# Altium schematic sheet AM3359_A.SchDoc: cihan
size A2; CompanyName: ENVEST; Engineer: CİHAN ÖZDİL
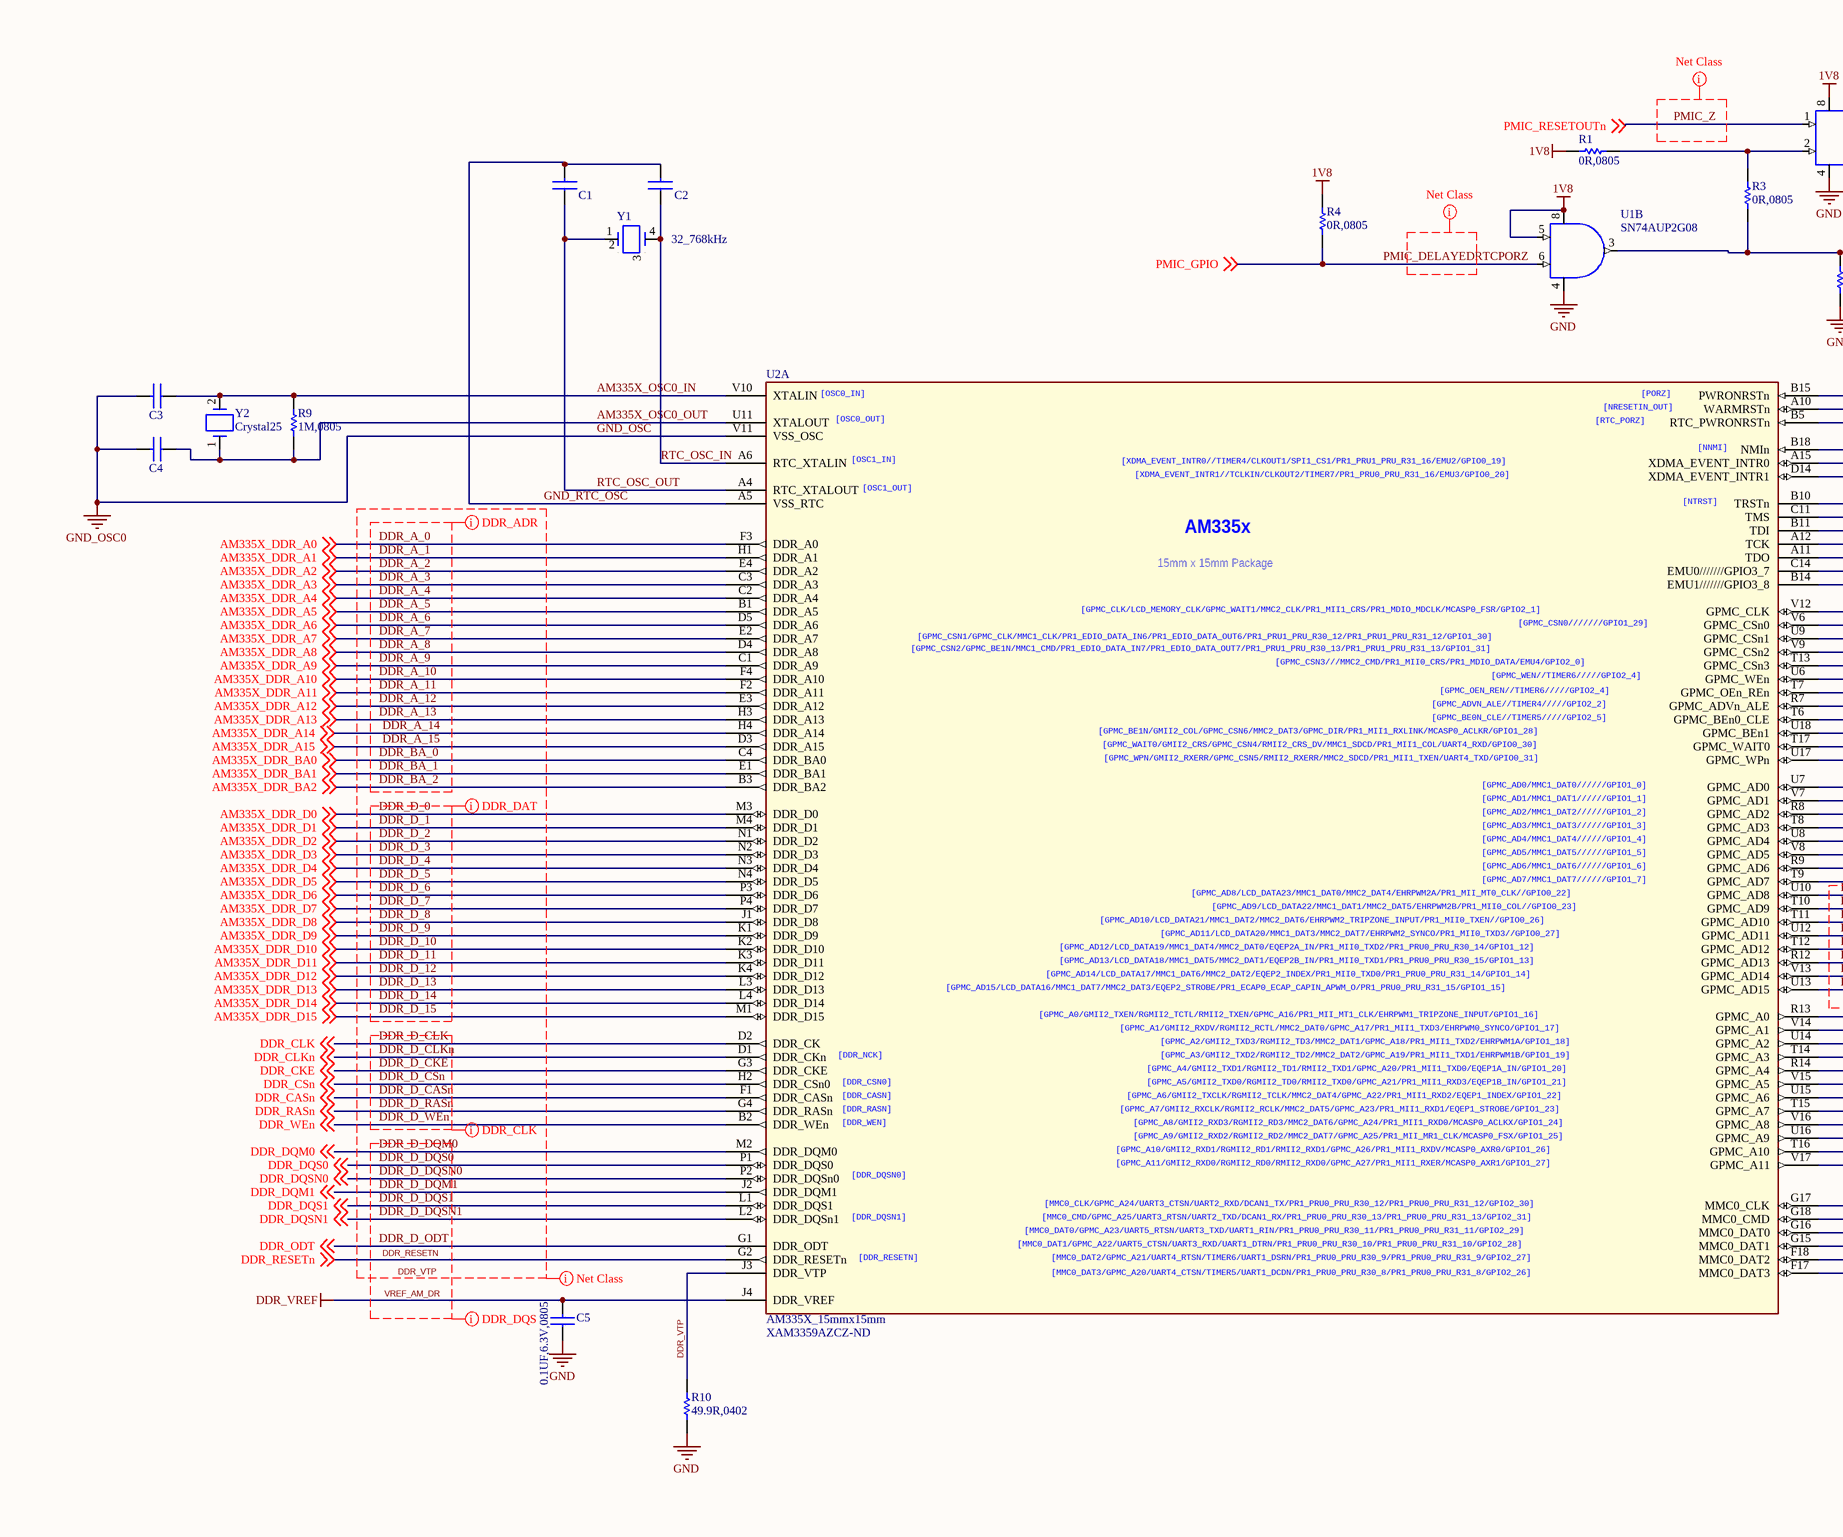
[diagram p0: AM3359_A.SchDoc, left]
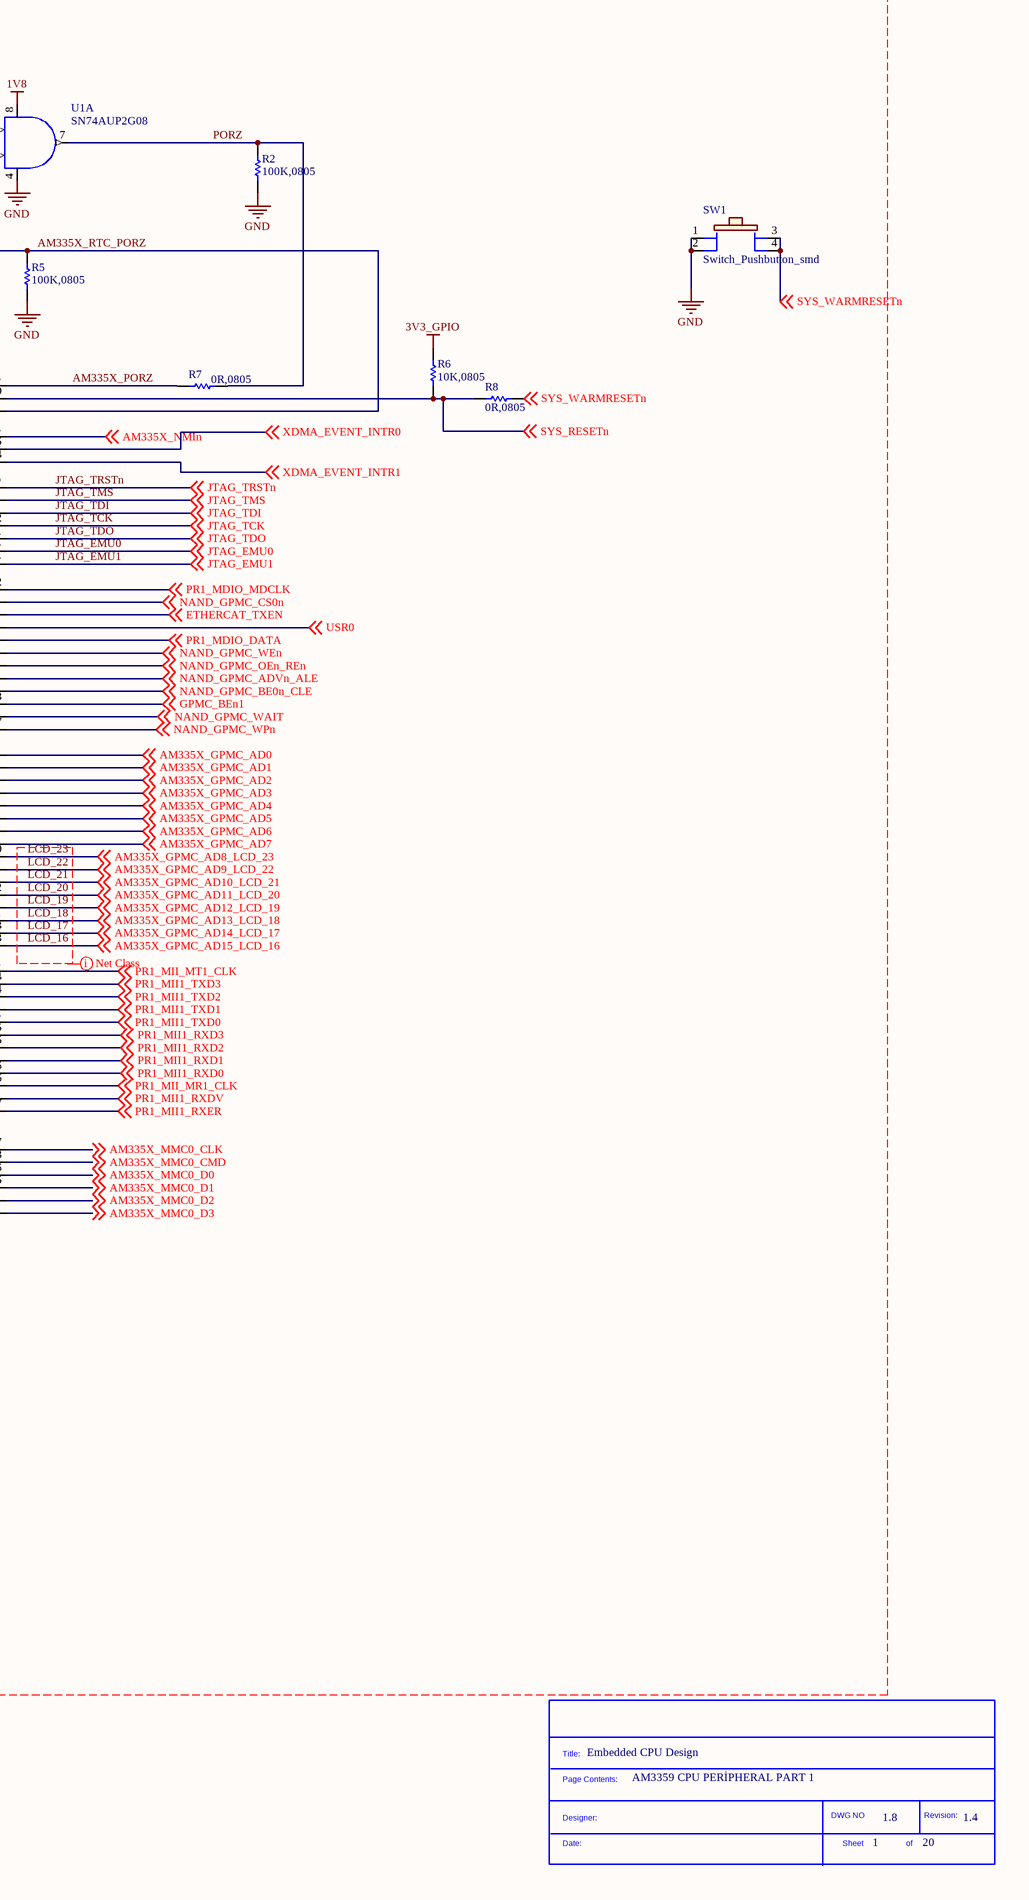
[diagram p1: AM3359_A.SchDoc, right]

## Parts
*?  SDTitleBlock  (value not drawn)  (graphical)
C1  18PF,50V,0805  [0402]  (value not drawn)
C2  18PF,50V,0805  [0402]  (value not drawn)
C3  18PF,50V,0805  [0402]  (value not drawn)
C4  18PF,50V,0805  [0402]  (value not drawn)
C5  0.1UF,6.3V,0805  [0402]
R1  0R,0805  [0402]
R2  100K,0805  [0402]
R3  0R,0805  [0402]
R4  0R,0805  [0402]
R5  100K,0805  [0402]
R6  10K,0805  [0402]
R7  0R,0805  [0402]
R8  0R,0805  [0402]
R9  1M,0805  [0402]
R10  49.9R,0402  [0402]
SW1  Switch_Pushbutton_smd  [SW_B3SL-1022P]
U1  SN74AUP2G08  [U_8_DCU]  (parts A,B of 2)
U2  AM335X_15mmx15mm  Supplier Part Number 1: XAM3359AZCZ-ND  [am33xx_15x15]  (part A of 3)
Y1  32_768kHz  [CRSTAL_RTC]
Y2  Crystal25  [SM_OSC_ABM3]

## Nets
1V8: R1.2 R4.2 U1.5(2A) U1.8(VCC)
3V3_GPIO: R6.2
GND: C5.1 R2.1 R5.1 R10.1 SW1.1 SW1.2 U1.4(GND)
GND_OSC: C3.2 C4.2 U2.V11(VSS_OSC)  [also labelled GND_OSC0]
VREF_AM_DR: C5.2 U2.J4(DDR_VREF)  [also labelled DDR_VREF]
AM335X_GPMC_AD0: U2.U7(GPMC_AD0) ; off-sheet AM335X_GPMC_AD0
AM335X_GPMC_AD1: U2.V7(GPMC_AD1) ; off-sheet AM335X_GPMC_AD1
AM335X_GPMC_AD2: U2.R8(GPMC_AD2) ; off-sheet AM335X_GPMC_AD2
AM335X_GPMC_AD3: U2.T8(GPMC_AD3) ; off-sheet AM335X_GPMC_AD3
AM335X_GPMC_AD4: U2.U8(GPMC_AD4) ; off-sheet AM335X_GPMC_AD4
AM335X_GPMC_AD5: U2.V8(GPMC_AD5) ; off-sheet AM335X_GPMC_AD5
AM335X_GPMC_AD6: U2.R9(GPMC_AD6) ; off-sheet AM335X_GPMC_AD6
AM335X_GPMC_AD7: U2.T9(GPMC_AD7) ; off-sheet AM335X_GPMC_AD7
AM335X_MMC0_CLK: U2.G17(MMC0_CLK) ; off-sheet AM335X_MMC0_CLK
AM335X_MMC0_CMD: U2.G18(MMC0_CMD) ; off-sheet AM335X_MMC0_CMD
AM335X_MMC0_D0: U2.G16(MMC0_DAT0) ; off-sheet AM335X_MMC0_D0
AM335X_MMC0_D1: U2.G15(MMC0_DAT1) ; off-sheet AM335X_MMC0_D1
AM335X_MMC0_D2: U2.F18(MMC0_DAT2) ; off-sheet AM335X_MMC0_D2
AM335X_MMC0_D3: U2.F17(MMC0_DAT3) ; off-sheet AM335X_MMC0_D3
AM335X_NMIn: U2.B18(NMIn) ; off-sheet AM335X_NMIn
AM335X_OSC0_IN: C3.1 R9.2 U2.V10(XTALIN) Y2.2
AM335X_OSC0_OUT: C4.1 R9.1 U2.U11(XTALOUT) Y2.1
AM335X_PORZ: R7.1 U2.B15(PWRONRSTn)
AM335X_RTC_PORZ: R3.1 R5.2 U1.3(2Y) U2.B5(RTC_PWRONRSTn)
DDR_A_0: U2.F3(DDR_A0) ; off-sheet AM335X_DDR_A0  [also labelled AM335X_DDR_A0]
DDR_A_1: U2.H1(DDR_A1) ; off-sheet AM335X_DDR_A1  [also labelled AM335X_DDR_A1]
DDR_A_2: U2.E4(DDR_A2) ; off-sheet AM335X_DDR_A2  [also labelled AM335X_DDR_A2]
DDR_A_3: U2.C3(DDR_A3) ; off-sheet AM335X_DDR_A3  [also labelled AM335X_DDR_A3]
DDR_A_4: U2.C2(DDR_A4) ; off-sheet AM335X_DDR_A4  [also labelled AM335X_DDR_A4]
DDR_A_5: U2.B1(DDR_A5) ; off-sheet AM335X_DDR_A5  [also labelled AM335X_DDR_A5]
DDR_A_6: U2.D5(DDR_A6) ; off-sheet AM335X_DDR_A6  [also labelled AM335X_DDR_A6]
DDR_A_7: U2.E2(DDR_A7) ; off-sheet AM335X_DDR_A7  [also labelled AM335X_DDR_A7]
DDR_A_8: U2.D4(DDR_A8) ; off-sheet AM335X_DDR_A8  [also labelled AM335X_DDR_A8]
DDR_A_9: U2.C1(DDR_A9) ; off-sheet AM335X_DDR_A9  [also labelled AM335X_DDR_A9]
DDR_A_10: U2.F4(DDR_A10) ; off-sheet AM335X_DDR_A10  [also labelled AM335X_DDR_A10]
DDR_A_11: U2.F2(DDR_A11) ; off-sheet AM335X_DDR_A11  [also labelled AM335X_DDR_A11]
DDR_A_12: U2.E3(DDR_A12) ; off-sheet AM335X_DDR_A12  [also labelled AM335X_DDR_A12]
DDR_A_13: U2.H3(DDR_A13) ; off-sheet AM335X_DDR_A13  [also labelled AM335X_DDR_A13]
DDR_A_14: U2.H4(DDR_A14) ; off-sheet AM335X_DDR_A14  [also labelled AM335X_DDR_A14]
DDR_A_15: U2.D3(DDR_A15) ; off-sheet AM335X_DDR_A15  [also labelled AM335X_DDR_A15]
DDR_BA_0: U2.C4(DDR_BA0) ; off-sheet AM335X_DDR_BA0  [also labelled AM335X_DDR_BA0]
DDR_BA_1: U2.E1(DDR_BA1) ; off-sheet AM335X_DDR_BA1  [also labelled AM335X_DDR_BA1]
DDR_BA_2: U2.B3(DDR_BA2) ; off-sheet AM335X_DDR_BA2  [also labelled AM335X_DDR_BA2]
DDR_D_0: U2.M3(DDR_D0) ; off-sheet AM335X_DDR_D0  [also labelled AM335X_DDR_D0]
DDR_D_1: U2.M4(DDR_D1) ; off-sheet AM335X_DDR_D1  [also labelled AM335X_DDR_D1]
DDR_D_2: U2.N1(DDR_D2) ; off-sheet AM335X_DDR_D2  [also labelled AM335X_DDR_D2]
DDR_D_3: U2.N2(DDR_D3) ; off-sheet AM335X_DDR_D3  [also labelled AM335X_DDR_D3]
DDR_D_4: U2.N3(DDR_D4) ; off-sheet AM335X_DDR_D4  [also labelled AM335X_DDR_D4]
DDR_D_5: U2.N4(DDR_D5) ; off-sheet AM335X_DDR_D5  [also labelled AM335X_DDR_D5]
DDR_D_6: U2.P3(DDR_D6) ; off-sheet AM335X_DDR_D6  [also labelled AM335X_DDR_D6]
DDR_D_7: U2.P4(DDR_D7) ; off-sheet AM335X_DDR_D7  [also labelled AM335X_DDR_D7]
DDR_D_8: U2.J1(DDR_D8) ; off-sheet AM335X_DDR_D8  [also labelled AM335X_DDR_D8]
DDR_D_9: U2.K1(DDR_D9) ; off-sheet AM335X_DDR_D9  [also labelled AM335X_DDR_D9]
DDR_D_10: U2.K2(DDR_D10) ; off-sheet AM335X_DDR_D10  [also labelled AM335X_DDR_D10]
DDR_D_11: U2.K3(DDR_D11) ; off-sheet AM335X_DDR_D11  [also labelled AM335X_DDR_D11]
DDR_D_12: U2.K4(DDR_D12) ; off-sheet AM335X_DDR_D12  [also labelled AM335X_DDR_D12]
DDR_D_13: U2.L3(DDR_D13) ; off-sheet AM335X_DDR_D13  [also labelled AM335X_DDR_D13]
DDR_D_14: U2.L4(DDR_D14) ; off-sheet AM335X_DDR_D14  [also labelled AM335X_DDR_D14]
DDR_D_15: U2.M1(DDR_D15) ; off-sheet AM335X_DDR_D15  [also labelled AM335X_DDR_D15]
DDR_D_CASn: U2.F1(DDR_CASn) ; off-sheet DDR_CASn  [also labelled DDR_CASn]
DDR_D_CKE: U2.G3(DDR_CKE) ; off-sheet DDR_CKE  [also labelled DDR_CKE]
DDR_D_CLK: U2.D2(DDR_CK) ; off-sheet DDR_CLK  [also labelled DDR_CLK]
DDR_D_CLKn: U2.D1(DDR_CKn) ; off-sheet DDR_CLKn  [also labelled DDR_CLKn]
DDR_D_CSn: U2.H2(DDR_CSn0) ; off-sheet DDR_CSn  [also labelled DDR_CSn]
DDR_D_DQM0: U2.M2(DDR_DQM0) ; off-sheet DDR_DQM0  [also labelled DDR_DQM0]
DDR_D_DQM1: U2.J2(DDR_DQM1) ; off-sheet DDR_DQM1  [also labelled DDR_DQM1]
DDR_D_DQS0: U2.P1(DDR_DQS0) ; off-sheet DDR_DQS0  [also labelled DDR_DQS0]
DDR_D_DQS1: U2.L1(DDR_DQS1) ; off-sheet DDR_DQS1  [also labelled DDR_DQS1]
DDR_D_DQSN0: U2.P2(DDR_DQSn0) ; off-sheet DDR_DQSN0  [also labelled DDR_DQSN0]
DDR_D_DQSN1: U2.L2(DDR_DQSn1) ; off-sheet DDR_DQSN1  [also labelled DDR_DQSN1]
DDR_D_ODT: U2.G1(DDR_ODT) ; off-sheet DDR_ODT  [also labelled DDR_ODT]
DDR_D_RASn: U2.G4(DDR_RASn) ; off-sheet DDR_RASn  [also labelled DDR_RASn]
DDR_D_WEn: U2.B2(DDR_WEn) ; off-sheet DDR_WEn  [also labelled DDR_WEn]
DDR_RESETN: U2.G2(DDR_RESETn) ; off-sheet DDR_RESETn
DDR_VTP: R10.2 U2.J3(DDR_VTP)
ETHERCAT_TXEN: U2.U9(GPMC_CSn1) ; off-sheet ETHERCAT_TXEN
GND_RTC_OSC: C1.2 C2.2 U2.A5(VSS_RTC)
GPMC_BEn1: U2.U18(GPMC_BEn1) ; off-sheet GPMC_BEn1
JTAG_EMU0: U2.C14(EMU0///////GPIO3_7) ; off-sheet JTAG_EMU0
JTAG_EMU1: U2.B14(EMU1///////GPIO3_8) ; off-sheet JTAG_EMU1
JTAG_TCK: U2.A12(TCK) ; off-sheet JTAG_TCK
JTAG_TDI: U2.B11(TDI) ; off-sheet JTAG_TDI
JTAG_TDO: U2.A11(TDO) ; off-sheet JTAG_TDO
JTAG_TMS: U2.C11(TMS) ; off-sheet JTAG_TMS
JTAG_TRSTn: U2.B10(TRSTn) ; off-sheet JTAG_TRSTn
LCD_16: U2.U13(GPMC_AD15) ; off-sheet AM335X_GPMC_AD15_LCD_16  [also labelled AM335X_GPMC_AD15_LCD_16]
LCD_17: U2.V13(GPMC_AD14) ; off-sheet AM335X_GPMC_AD14_LCD_17  [also labelled AM335X_GPMC_AD14_LCD_17]
LCD_18: U2.R12(GPMC_AD13) ; off-sheet AM335X_GPMC_AD13_LCD_18  [also labelled AM335X_GPMC_AD13_LCD_18]
LCD_19: U2.T12(GPMC_AD12) ; off-sheet AM335X_GPMC_AD12_LCD_19  [also labelled AM335X_GPMC_AD12_LCD_19]
LCD_20: U2.U12(GPMC_AD11) ; off-sheet AM335X_GPMC_AD11_LCD_20  [also labelled AM335X_GPMC_AD11_LCD_20]
LCD_21: U2.T11(GPMC_AD10) ; off-sheet AM335X_GPMC_AD10_LCD_21  [also labelled AM335X_GPMC_AD10_LCD_21]
LCD_22: U2.T10(GPMC_AD9) ; off-sheet AM335X_GPMC_AD9_LCD_22  [also labelled AM335X_GPMC_AD9_LCD_22]
LCD_23: U2.U10(GPMC_AD8) ; off-sheet AM335X_GPMC_AD8_LCD_23  [also labelled AM335X_GPMC_AD8_LCD_23]
NAND_GPMC_ADVn_ALE: U2.R7(GPMC_ADVn_ALE) ; off-sheet NAND_GPMC_ADVn_ALE
NAND_GPMC_BE0n_CLE: U2.T6(GPMC_BEn0_CLE) ; off-sheet NAND_GPMC_BE0n_CLE
NAND_GPMC_CS0n: U2.V6(GPMC_CSn0) ; off-sheet NAND_GPMC_CS0n
NAND_GPMC_OEn_REn: U2.T7(GPMC_OEn_REn) ; off-sheet NAND_GPMC_OEn_REn
NAND_GPMC_WAIT: U2.T17(GPMC_WAIT0) ; off-sheet NAND_GPMC_WAIT
NAND_GPMC_WEn: U2.U6(GPMC_WEn) ; off-sheet NAND_GPMC_WEn
NAND_GPMC_WPn: U2.U17(GPMC_WPn) ; off-sheet NAND_GPMC_WPn
PMIC_DELAYEDRTCPORZ: R4.1 U1.6(2B) ; off-sheet PMIC_GPIO  [also labelled PMIC_GPIO]
PMIC_Z: U1.1(2A) ; off-sheet PMIC_RESETOUTn  [also labelled PMIC_RESETOUTn]
PORZ: R2.2 R7.2 U1.7(2Y)
PR1_MDIO_DATA: U2.T13(GPMC_CSn3) ; off-sheet PR1_MDIO_DATA
PR1_MDIO_MDCLK: U2.V12(GPMC_CLK) ; off-sheet PR1_MDIO_MDCLK
PR1_MII1_RXD0: U2.V16(GPMC_A8) ; off-sheet PR1_MII1_RXD0
PR1_MII1_RXD1: U2.T15(GPMC_A7) ; off-sheet PR1_MII1_RXD1
PR1_MII1_RXD2: U2.U15(GPMC_A6) ; off-sheet PR1_MII1_RXD2
PR1_MII1_RXD3: U2.V15(GPMC_A5) ; off-sheet PR1_MII1_RXD3
PR1_MII1_RXDV: U2.T16(GPMC_A10) ; off-sheet PR1_MII1_RXDV
PR1_MII1_RXER: U2.V17(GPMC_A11) ; off-sheet PR1_MII1_RXER
PR1_MII1_TXD0: U2.R14(GPMC_A4) ; off-sheet PR1_MII1_TXD0
PR1_MII1_TXD1: U2.T14(GPMC_A3) ; off-sheet PR1_MII1_TXD1
PR1_MII1_TXD2: U2.U14(GPMC_A2) ; off-sheet PR1_MII1_TXD2
PR1_MII1_TXD3: U2.V14(GPMC_A1) ; off-sheet PR1_MII1_TXD3
PR1_MII_MR1_CLK: U2.U16(GPMC_A9) ; off-sheet PR1_MII_MR1_CLK
PR1_MII_MT1_CLK: U2.R13(GPMC_A0) ; off-sheet PR1_MII_MT1_CLK
RTC_OSC_IN: C2.1 U2.A6(RTC_XTALIN) Y1.4
RTC_OSC_OUT: C1.1 U2.A4(RTC_XTALOUT) Y1.1
SYS_RESETn: R6.1 R8.1 U2.A10(WARMRSTn) ; off-sheet SYS_RESETn
SYS_WARMRESETn: R8.2 SW1.3 SW1.4 ; off-sheet SYS_WARMRESETn
USR0: U2.V9(GPMC_CSn2) ; off-sheet USR0
XDMA_EVENT_INTR0: U2.A15(XDMA_EVENT_INTR0) ; off-sheet XDMA_EVENT_INTR0
XDMA_EVENT_INTR1: U2.D14(XDMA_EVENT_INTR1) ; off-sheet XDMA_EVENT_INTR1
NetR1_1: R1.1 R3.2 U1.2(2B)

Not connected (* = marked no-connect by the designer): Y1 2 3

## Layout directives
net class AM335PRST: (no net found under the mark), PMIC_Z
net class AM335X_A: 1V8, 3V3_GPIO, AM335X_DDR_A0, AM335X_DDR_A1, AM335X_DDR_A2, AM335X_DDR_A3, AM335X_DDR_A4, AM335X_DDR_A5, AM335X_DDR_A6, AM335X_DDR_A7, AM335X_DDR_A8, AM335X_DDR_A9, AM335X_DDR_A10, AM335X_DDR_A11, AM335X_DDR_A12, AM335X_DDR_A13, AM335X_DDR_A14, AM335X_DDR_A15, AM335X_DDR_BA0, AM335X_DDR_BA1, AM335X_DDR_BA2, AM335X_DDR_D0, AM335X_DDR_D1, AM335X_DDR_D2, AM335X_DDR_D3, AM335X_DDR_D4, AM335X_DDR_D5, AM335X_DDR_D6, AM335X_DDR_D7, AM335X_DDR_D8, AM335X_DDR_D9, AM335X_DDR_D10, AM335X_DDR_D11, AM335X_DDR_D12, AM335X_DDR_D13, AM335X_DDR_D14, AM335X_DDR_D15, AM335X_GPMC_AD0, AM335X_GPMC_AD1, AM335X_GPMC_AD2, AM335X_GPMC_AD3, AM335X_GPMC_AD4, AM335X_GPMC_AD5, AM335X_GPMC_AD6, AM335X_GPMC_AD7, AM335X_GPMC_AD8_LCD_23, AM335X_GPMC_AD9_LCD_22, AM335X_GPMC_AD10_LCD_21, AM335X_GPMC_AD11_LCD_20, AM335X_GPMC_AD12_LCD_19, AM335X_GPMC_AD13_LCD_18, AM335X_GPMC_AD14_LCD_17, AM335X_GPMC_AD15_LCD_16, AM335X_MMC0_CLK, AM335X_MMC0_CMD, AM335X_MMC0_D0, AM335X_MMC0_D1, AM335X_MMC0_D2, AM335X_MMC0_D3, AM335X_NMIn, AM335X_OSC0_IN, AM335X_OSC0_OUT, AM335X_PORZ, AM335X_RTC_PORZ, DDR_A_0, DDR_A_1, DDR_A_2, DDR_A_3, DDR_A_4, DDR_A_5, DDR_A_6, DDR_A_7, DDR_A_8, DDR_A_9, DDR_A_10, DDR_A_11, DDR_A_12, DDR_A_13, DDR_A_14, DDR_A_15, DDR_BA_0, DDR_BA_1, DDR_BA_2, DDR_CASn, DDR_CKE, DDR_CLK, DDR_CLKn, DDR_CSn, DDR_D_0, DDR_D_1, DDR_D_2, DDR_D_3, DDR_D_4, DDR_D_5, DDR_D_6, DDR_D_7, DDR_D_8, DDR_D_9, DDR_D_10, DDR_D_11, DDR_D_12, DDR_D_13, DDR_D_14, DDR_D_15, DDR_D_CASn, DDR_D_CKE, DDR_D_CLK, DDR_D_CLKn, DDR_D_CSn, DDR_D_DQM0, DDR_D_DQM1, DDR_D_DQS0, DDR_D_DQS1, DDR_D_DQSN0, DDR_D_DQSN1, DDR_D_ODT, DDR_D_RASn, DDR_D_WEn, DDR_DQM0, DDR_DQM1, DDR_DQS0, DDR_DQS1, DDR_DQSN0, DDR_DQSN1, DDR_ODT, DDR_RASn, DDR_RESETn, DDR_RESETN, DDR_VREF, DDR_VTP, DDR_WEn, ETHERCAT_TXEN, GND, GND_OSC, GND_OSC0, GND_RTC_OSC, GPMC_BEn1, JTAG_EMU0, JTAG_EMU1, JTAG_TCK, JTAG_TDI, JTAG_TDO, JTAG_TMS, JTAG_TRSTn, LCD_16, LCD_17, LCD_18, LCD_19, LCD_20, LCD_21, LCD_22, LCD_23, NAND_GPMC_ADVn_ALE, NAND_GPMC_BE0n_CLE, NAND_GPMC_CS0n, NAND_GPMC_OEn_REn, NAND_GPMC_WAIT, NAND_GPMC_WEn, NAND_GPMC_WPn, PMIC_DELAYEDRTCPORZ, PMIC_GPIO, PMIC_RESETOUTn, PMIC_Z, PORZ, PR1_MDIO_DATA, PR1_MDIO_MDCLK, PR1_MII1_RXD0, PR1_MII1_RXD1, PR1_MII1_RXD2, PR1_MII1_RXD3, PR1_MII1_RXDV, PR1_MII1_RXER, PR1_MII1_TXD0, PR1_MII1_TXD1, PR1_MII1_TXD2, PR1_MII1_TXD3, PR1_MII_MR1_CLK, PR1_MII_MT1_CLK, RTC_OSC_IN, RTC_OSC_OUT, SYS_RESETn, SYS_WARMRESETn, USR0, VREF_AM_DR, XDMA_EVENT_INTR0, XDMA_EVENT_INTR1
net class LCD_2: 1V8, 3V3_GPIO, AM335X_DDR_A0, AM335X_DDR_A1, AM335X_DDR_A2, AM335X_DDR_A3, AM335X_DDR_A4, AM335X_DDR_A5, AM335X_DDR_A6, AM335X_DDR_A7, AM335X_DDR_A8, AM335X_DDR_A9, AM335X_DDR_A10, AM335X_DDR_A11, AM335X_DDR_A12, AM335X_DDR_A13, AM335X_DDR_A14, AM335X_DDR_A15, AM335X_DDR_BA0, AM335X_DDR_BA1, AM335X_DDR_BA2, AM335X_DDR_D0, AM335X_DDR_D1, AM335X_DDR_D2, AM335X_DDR_D3, AM335X_DDR_D4, AM335X_DDR_D5, AM335X_DDR_D6, AM335X_DDR_D7, AM335X_DDR_D8, AM335X_DDR_D9, AM335X_DDR_D10, AM335X_DDR_D11, AM335X_DDR_D12, AM335X_DDR_D13, AM335X_DDR_D14, AM335X_DDR_D15, AM335X_GPMC_AD0, AM335X_GPMC_AD1, AM335X_GPMC_AD2, AM335X_GPMC_AD3, AM335X_GPMC_AD4, AM335X_GPMC_AD5, AM335X_GPMC_AD6, AM335X_GPMC_AD7, AM335X_GPMC_AD8_LCD_23, AM335X_GPMC_AD9_LCD_22, AM335X_GPMC_AD10_LCD_21, AM335X_GPMC_AD11_LCD_20, AM335X_GPMC_AD12_LCD_19, AM335X_GPMC_AD13_LCD_18, AM335X_GPMC_AD14_LCD_17, AM335X_GPMC_AD15_LCD_16, AM335X_MMC0_CLK, AM335X_MMC0_CMD, AM335X_MMC0_D0, AM335X_MMC0_D1, AM335X_MMC0_D2, AM335X_MMC0_D3, AM335X_NMIn, AM335X_OSC0_IN, AM335X_OSC0_OUT, AM335X_PORZ, AM335X_RTC_PORZ, DDR_A_0, DDR_A_1, DDR_A_2, DDR_A_3, DDR_A_4, DDR_A_5, DDR_A_6, DDR_A_7, DDR_A_8, DDR_A_9, DDR_A_10, DDR_A_11, DDR_A_12, DDR_A_13, DDR_A_14, DDR_A_15, DDR_BA_0, DDR_BA_1, DDR_BA_2, DDR_CASn, DDR_CKE, DDR_CLK, DDR_CLKn, DDR_CSn, DDR_D_0, DDR_D_1, DDR_D_2, DDR_D_3, DDR_D_4, DDR_D_5, DDR_D_6, DDR_D_7, DDR_D_8, DDR_D_9, DDR_D_10, DDR_D_11, DDR_D_12, DDR_D_13, DDR_D_14, DDR_D_15, DDR_D_CASn, DDR_D_CKE, DDR_D_CLK, DDR_D_CLKn, DDR_D_CSn, DDR_D_DQM0, DDR_D_DQM1, DDR_D_DQS0, DDR_D_DQS1, DDR_D_DQSN0, DDR_D_DQSN1, DDR_D_ODT, DDR_D_RASn, DDR_D_WEn, DDR_DQM0, DDR_DQM1, DDR_DQS0, DDR_DQS1, DDR_DQSN0, DDR_DQSN1, DDR_ODT, DDR_RASn, DDR_RESETn, DDR_RESETN, DDR_VREF, DDR_VTP, DDR_WEn, ETHERCAT_TXEN, GND, GND_OSC, GND_OSC0, GND_RTC_OSC, GPMC_BEn1, JTAG_EMU0, JTAG_EMU1, JTAG_TCK, JTAG_TDI, JTAG_TDO, JTAG_TMS, JTAG_TRSTn, LCD_16, LCD_17, LCD_18, LCD_19, LCD_20, LCD_21, LCD_22, LCD_23, NAND_GPMC_ADVn_ALE, NAND_GPMC_BE0n_CLE, NAND_GPMC_CS0n, NAND_GPMC_OEn_REn, NAND_GPMC_WAIT, NAND_GPMC_WEn, NAND_GPMC_WPn, PMIC_DELAYEDRTCPORZ, PMIC_GPIO, PMIC_RESETOUTn, PMIC_Z, PORZ, PR1_MDIO_DATA, PR1_MDIO_MDCLK, PR1_MII1_RXD0, PR1_MII1_RXD1, PR1_MII1_RXD2, PR1_MII1_RXD3, PR1_MII1_RXDV, PR1_MII1_RXER, PR1_MII1_TXD0, PR1_MII1_TXD1, PR1_MII1_TXD2, PR1_MII1_TXD3, PR1_MII_MR1_CLK, PR1_MII_MT1_CLK, RTC_OSC_IN, RTC_OSC_OUT, SYS_RESETn, SYS_WARMRESETn, USR0, VREF_AM_DR, XDMA_EVENT_INTR0, XDMA_EVENT_INTR1
net class DDR_ADR: 1V8, 3V3_GPIO, AM335X_DDR_A0, AM335X_DDR_A1, AM335X_DDR_A2, AM335X_DDR_A3, AM335X_DDR_A4, AM335X_DDR_A5, AM335X_DDR_A6, AM335X_DDR_A7, AM335X_DDR_A8, AM335X_DDR_A9, AM335X_DDR_A10, AM335X_DDR_A11, AM335X_DDR_A12, AM335X_DDR_A13, AM335X_DDR_A14, AM335X_DDR_A15, AM335X_DDR_BA0, AM335X_DDR_BA1, AM335X_DDR_BA2, AM335X_DDR_D0, AM335X_DDR_D1, AM335X_DDR_D2, AM335X_DDR_D3, AM335X_DDR_D4, AM335X_DDR_D5, AM335X_DDR_D6, AM335X_DDR_D7, AM335X_DDR_D8, AM335X_DDR_D9, AM335X_DDR_D10, AM335X_DDR_D11, AM335X_DDR_D12, AM335X_DDR_D13, AM335X_DDR_D14, AM335X_DDR_D15, AM335X_GPMC_AD0, AM335X_GPMC_AD1, AM335X_GPMC_AD2, AM335X_GPMC_AD3, AM335X_GPMC_AD4, AM335X_GPMC_AD5, AM335X_GPMC_AD6, AM335X_GPMC_AD7, AM335X_GPMC_AD8_LCD_23, AM335X_GPMC_AD9_LCD_22, AM335X_GPMC_AD10_LCD_21, AM335X_GPMC_AD11_LCD_20, AM335X_GPMC_AD12_LCD_19, AM335X_GPMC_AD13_LCD_18, AM335X_GPMC_AD14_LCD_17, AM335X_GPMC_AD15_LCD_16, AM335X_MMC0_CLK, AM335X_MMC0_CMD, AM335X_MMC0_D0, AM335X_MMC0_D1, AM335X_MMC0_D2, AM335X_MMC0_D3, AM335X_NMIn, AM335X_OSC0_IN, AM335X_OSC0_OUT, AM335X_PORZ, AM335X_RTC_PORZ, DDR_A_0, DDR_A_1, DDR_A_2, DDR_A_3, DDR_A_4, DDR_A_5, DDR_A_6, DDR_A_7, DDR_A_8, DDR_A_9, DDR_A_10, DDR_A_11, DDR_A_12, DDR_A_13, DDR_A_14, DDR_A_15, DDR_BA_0, DDR_BA_1, DDR_BA_2, DDR_CASn, DDR_CKE, DDR_CLK, DDR_CLKn, DDR_CSn, DDR_D_0, DDR_D_1, DDR_D_2, DDR_D_3, DDR_D_4, DDR_D_5, DDR_D_6, DDR_D_7, DDR_D_8, DDR_D_9, DDR_D_10, DDR_D_11, DDR_D_12, DDR_D_13, DDR_D_14, DDR_D_15, DDR_D_CASn, DDR_D_CKE, DDR_D_CLK, DDR_D_CLKn, DDR_D_CSn, DDR_D_DQM0, DDR_D_DQM1, DDR_D_DQS0, DDR_D_DQS1, DDR_D_DQSN0, DDR_D_DQSN1, DDR_D_ODT, DDR_D_RASn, DDR_D_WEn, DDR_DQM0, DDR_DQM1, DDR_DQS0, DDR_DQS1, DDR_DQSN0, DDR_DQSN1, DDR_ODT, DDR_RASn, DDR_RESETn, DDR_RESETN, DDR_VREF, DDR_VTP, DDR_WEn, ETHERCAT_TXEN, GND, GND_OSC, GND_OSC0, GND_RTC_OSC, GPMC_BEn1, JTAG_EMU0, JTAG_EMU1, JTAG_TCK, JTAG_TDI, JTAG_TDO, JTAG_TMS, JTAG_TRSTn, LCD_16, LCD_17, LCD_18, LCD_19, LCD_20, LCD_21, LCD_22, LCD_23, NAND_GPMC_ADVn_ALE, NAND_GPMC_BE0n_CLE, NAND_GPMC_CS0n, NAND_GPMC_OEn_REn, NAND_GPMC_WAIT, NAND_GPMC_WEn, NAND_GPMC_WPn, PMIC_DELAYEDRTCPORZ, PMIC_GPIO, PMIC_RESETOUTn, PMIC_Z, PORZ, PR1_MDIO_DATA, PR1_MDIO_MDCLK, PR1_MII1_RXD0, PR1_MII1_RXD1, PR1_MII1_RXD2, PR1_MII1_RXD3, PR1_MII1_RXDV, PR1_MII1_RXER, PR1_MII1_TXD0, PR1_MII1_TXD1, PR1_MII1_TXD2, PR1_MII1_TXD3, PR1_MII_MR1_CLK, PR1_MII_MT1_CLK, RTC_OSC_IN, RTC_OSC_OUT, SYS_RESETn, SYS_WARMRESETn, USR0, VREF_AM_DR, XDMA_EVENT_INTR0, XDMA_EVENT_INTR1
net class DDR_DAT: 1V8, 3V3_GPIO, AM335X_DDR_A0, AM335X_DDR_A1, AM335X_DDR_A2, AM335X_DDR_A3, AM335X_DDR_A4, AM335X_DDR_A5, AM335X_DDR_A6, AM335X_DDR_A7, AM335X_DDR_A8, AM335X_DDR_A9, AM335X_DDR_A10, AM335X_DDR_A11, AM335X_DDR_A12, AM335X_DDR_A13, AM335X_DDR_A14, AM335X_DDR_A15, AM335X_DDR_BA0, AM335X_DDR_BA1, AM335X_DDR_BA2, AM335X_DDR_D0, AM335X_DDR_D1, AM335X_DDR_D2, AM335X_DDR_D3, AM335X_DDR_D4, AM335X_DDR_D5, AM335X_DDR_D6, AM335X_DDR_D7, AM335X_DDR_D8, AM335X_DDR_D9, AM335X_DDR_D10, AM335X_DDR_D11, AM335X_DDR_D12, AM335X_DDR_D13, AM335X_DDR_D14, AM335X_DDR_D15, AM335X_GPMC_AD0, AM335X_GPMC_AD1, AM335X_GPMC_AD2, AM335X_GPMC_AD3, AM335X_GPMC_AD4, AM335X_GPMC_AD5, AM335X_GPMC_AD6, AM335X_GPMC_AD7, AM335X_GPMC_AD8_LCD_23, AM335X_GPMC_AD9_LCD_22, AM335X_GPMC_AD10_LCD_21, AM335X_GPMC_AD11_LCD_20, AM335X_GPMC_AD12_LCD_19, AM335X_GPMC_AD13_LCD_18, AM335X_GPMC_AD14_LCD_17, AM335X_GPMC_AD15_LCD_16, AM335X_MMC0_CLK, AM335X_MMC0_CMD, AM335X_MMC0_D0, AM335X_MMC0_D1, AM335X_MMC0_D2, AM335X_MMC0_D3, AM335X_NMIn, AM335X_OSC0_IN, AM335X_OSC0_OUT, AM335X_PORZ, AM335X_RTC_PORZ, DDR_A_0, DDR_A_1, DDR_A_2, DDR_A_3, DDR_A_4, DDR_A_5, DDR_A_6, DDR_A_7, DDR_A_8, DDR_A_9, DDR_A_10, DDR_A_11, DDR_A_12, DDR_A_13, DDR_A_14, DDR_A_15, DDR_BA_0, DDR_BA_1, DDR_BA_2, DDR_CASn, DDR_CKE, DDR_CLK, DDR_CLKn, DDR_CSn, DDR_D_0, DDR_D_1, DDR_D_2, DDR_D_3, DDR_D_4, DDR_D_5, DDR_D_6, DDR_D_7, DDR_D_8, DDR_D_9, DDR_D_10, DDR_D_11, DDR_D_12, DDR_D_13, DDR_D_14, DDR_D_15, DDR_D_CASn, DDR_D_CKE, DDR_D_CLK, DDR_D_CLKn, DDR_D_CSn, DDR_D_DQM0, DDR_D_DQM1, DDR_D_DQS0, DDR_D_DQS1, DDR_D_DQSN0, DDR_D_DQSN1, DDR_D_ODT, DDR_D_RASn, DDR_D_WEn, DDR_DQM0, DDR_DQM1, DDR_DQS0, DDR_DQS1, DDR_DQSN0, DDR_DQSN1, DDR_ODT, DDR_RASn, DDR_RESETn, DDR_RESETN, DDR_VREF, DDR_VTP, DDR_WEn, ETHERCAT_TXEN, GND, GND_OSC, GND_OSC0, GND_RTC_OSC, GPMC_BEn1, JTAG_EMU0, JTAG_EMU1, JTAG_TCK, JTAG_TDI, JTAG_TDO, JTAG_TMS, JTAG_TRSTn, LCD_16, LCD_17, LCD_18, LCD_19, LCD_20, LCD_21, LCD_22, LCD_23, NAND_GPMC_ADVn_ALE, NAND_GPMC_BE0n_CLE, NAND_GPMC_CS0n, NAND_GPMC_OEn_REn, NAND_GPMC_WAIT, NAND_GPMC_WEn, NAND_GPMC_WPn, PMIC_DELAYEDRTCPORZ, PMIC_GPIO, PMIC_RESETOUTn, PMIC_Z, PORZ, PR1_MDIO_DATA, PR1_MDIO_MDCLK, PR1_MII1_RXD0, PR1_MII1_RXD1, PR1_MII1_RXD2, PR1_MII1_RXD3, PR1_MII1_RXDV, PR1_MII1_RXER, PR1_MII1_TXD0, PR1_MII1_TXD1, PR1_MII1_TXD2, PR1_MII1_TXD3, PR1_MII_MR1_CLK, PR1_MII_MT1_CLK, RTC_OSC_IN, RTC_OSC_OUT, SYS_RESETn, SYS_WARMRESETn, USR0, VREF_AM_DR, XDMA_EVENT_INTR0, XDMA_EVENT_INTR1
net class DDR_DQS: 1V8, 3V3_GPIO, AM335X_DDR_A0, AM335X_DDR_A1, AM335X_DDR_A2, AM335X_DDR_A3, AM335X_DDR_A4, AM335X_DDR_A5, AM335X_DDR_A6, AM335X_DDR_A7, AM335X_DDR_A8, AM335X_DDR_A9, AM335X_DDR_A10, AM335X_DDR_A11, AM335X_DDR_A12, AM335X_DDR_A13, AM335X_DDR_A14, AM335X_DDR_A15, AM335X_DDR_BA0, AM335X_DDR_BA1, AM335X_DDR_BA2, AM335X_DDR_D0, AM335X_DDR_D1, AM335X_DDR_D2, AM335X_DDR_D3, AM335X_DDR_D4, AM335X_DDR_D5, AM335X_DDR_D6, AM335X_DDR_D7, AM335X_DDR_D8, AM335X_DDR_D9, AM335X_DDR_D10, AM335X_DDR_D11, AM335X_DDR_D12, AM335X_DDR_D13, AM335X_DDR_D14, AM335X_DDR_D15, AM335X_GPMC_AD0, AM335X_GPMC_AD1, AM335X_GPMC_AD2, AM335X_GPMC_AD3, AM335X_GPMC_AD4, AM335X_GPMC_AD5, AM335X_GPMC_AD6, AM335X_GPMC_AD7, AM335X_GPMC_AD8_LCD_23, AM335X_GPMC_AD9_LCD_22, AM335X_GPMC_AD10_LCD_21, AM335X_GPMC_AD11_LCD_20, AM335X_GPMC_AD12_LCD_19, AM335X_GPMC_AD13_LCD_18, AM335X_GPMC_AD14_LCD_17, AM335X_GPMC_AD15_LCD_16, AM335X_MMC0_CLK, AM335X_MMC0_CMD, AM335X_MMC0_D0, AM335X_MMC0_D1, AM335X_MMC0_D2, AM335X_MMC0_D3, AM335X_NMIn, AM335X_OSC0_IN, AM335X_OSC0_OUT, AM335X_PORZ, AM335X_RTC_PORZ, DDR_A_0, DDR_A_1, DDR_A_2, DDR_A_3, DDR_A_4, DDR_A_5, DDR_A_6, DDR_A_7, DDR_A_8, DDR_A_9, DDR_A_10, DDR_A_11, DDR_A_12, DDR_A_13, DDR_A_14, DDR_A_15, DDR_BA_0, DDR_BA_1, DDR_BA_2, DDR_CASn, DDR_CKE, DDR_CLK, DDR_CLKn, DDR_CSn, DDR_D_0, DDR_D_1, DDR_D_2, DDR_D_3, DDR_D_4, DDR_D_5, DDR_D_6, DDR_D_7, DDR_D_8, DDR_D_9, DDR_D_10, DDR_D_11, DDR_D_12, DDR_D_13, DDR_D_14, DDR_D_15, DDR_D_CASn, DDR_D_CKE, DDR_D_CLK, DDR_D_CLKn, DDR_D_CSn, DDR_D_DQM0, DDR_D_DQM1, DDR_D_DQS0, DDR_D_DQS1, DDR_D_DQSN0, DDR_D_DQSN1, DDR_D_ODT, DDR_D_RASn, DDR_D_WEn, DDR_DQM0, DDR_DQM1, DDR_DQS0, DDR_DQS1, DDR_DQSN0, DDR_DQSN1, DDR_ODT, DDR_RASn, DDR_RESETn, DDR_RESETN, DDR_VREF, DDR_VTP, DDR_WEn, ETHERCAT_TXEN, GND, GND_OSC, GND_OSC0, GND_RTC_OSC, GPMC_BEn1, JTAG_EMU0, JTAG_EMU1, JTAG_TCK, JTAG_TDI, JTAG_TDO, JTAG_TMS, JTAG_TRSTn, LCD_16, LCD_17, LCD_18, LCD_19, LCD_20, LCD_21, LCD_22, LCD_23, NAND_GPMC_ADVn_ALE, NAND_GPMC_BE0n_CLE, NAND_GPMC_CS0n, NAND_GPMC_OEn_REn, NAND_GPMC_WAIT, NAND_GPMC_WEn, NAND_GPMC_WPn, PMIC_DELAYEDRTCPORZ, PMIC_GPIO, PMIC_RESETOUTn, PMIC_Z, PORZ, PR1_MDIO_DATA, PR1_MDIO_MDCLK, PR1_MII1_RXD0, PR1_MII1_RXD1, PR1_MII1_RXD2, PR1_MII1_RXD3, PR1_MII1_RXDV, PR1_MII1_RXER, PR1_MII1_TXD0, PR1_MII1_TXD1, PR1_MII1_TXD2, PR1_MII1_TXD3, PR1_MII_MR1_CLK, PR1_MII_MT1_CLK, RTC_OSC_IN, RTC_OSC_OUT, SYS_RESETn, SYS_WARMRESETn, USR0, VREF_AM_DR, XDMA_EVENT_INTR0, XDMA_EVENT_INTR1
net class DDR_CLK: 1V8, 3V3_GPIO, AM335X_DDR_A0, AM335X_DDR_A1, AM335X_DDR_A2, AM335X_DDR_A3, AM335X_DDR_A4, AM335X_DDR_A5, AM335X_DDR_A6, AM335X_DDR_A7, AM335X_DDR_A8, AM335X_DDR_A9, AM335X_DDR_A10, AM335X_DDR_A11, AM335X_DDR_A12, AM335X_DDR_A13, AM335X_DDR_A14, AM335X_DDR_A15, AM335X_DDR_BA0, AM335X_DDR_BA1, AM335X_DDR_BA2, AM335X_DDR_D0, AM335X_DDR_D1, AM335X_DDR_D2, AM335X_DDR_D3, AM335X_DDR_D4, AM335X_DDR_D5, AM335X_DDR_D6, AM335X_DDR_D7, AM335X_DDR_D8, AM335X_DDR_D9, AM335X_DDR_D10, AM335X_DDR_D11, AM335X_DDR_D12, AM335X_DDR_D13, AM335X_DDR_D14, AM335X_DDR_D15, AM335X_GPMC_AD0, AM335X_GPMC_AD1, AM335X_GPMC_AD2, AM335X_GPMC_AD3, AM335X_GPMC_AD4, AM335X_GPMC_AD5, AM335X_GPMC_AD6, AM335X_GPMC_AD7, AM335X_GPMC_AD8_LCD_23, AM335X_GPMC_AD9_LCD_22, AM335X_GPMC_AD10_LCD_21, AM335X_GPMC_AD11_LCD_20, AM335X_GPMC_AD12_LCD_19, AM335X_GPMC_AD13_LCD_18, AM335X_GPMC_AD14_LCD_17, AM335X_GPMC_AD15_LCD_16, AM335X_MMC0_CLK, AM335X_MMC0_CMD, AM335X_MMC0_D0, AM335X_MMC0_D1, AM335X_MMC0_D2, AM335X_MMC0_D3, AM335X_NMIn, AM335X_OSC0_IN, AM335X_OSC0_OUT, AM335X_PORZ, AM335X_RTC_PORZ, DDR_A_0, DDR_A_1, DDR_A_2, DDR_A_3, DDR_A_4, DDR_A_5, DDR_A_6, DDR_A_7, DDR_A_8, DDR_A_9, DDR_A_10, DDR_A_11, DDR_A_12, DDR_A_13, DDR_A_14, DDR_A_15, DDR_BA_0, DDR_BA_1, DDR_BA_2, DDR_CASn, DDR_CKE, DDR_CLK, DDR_CLKn, DDR_CSn, DDR_D_0, DDR_D_1, DDR_D_2, DDR_D_3, DDR_D_4, DDR_D_5, DDR_D_6, DDR_D_7, DDR_D_8, DDR_D_9, DDR_D_10, DDR_D_11, DDR_D_12, DDR_D_13, DDR_D_14, DDR_D_15, DDR_D_CASn, DDR_D_CKE, DDR_D_CLK, DDR_D_CLKn, DDR_D_CSn, DDR_D_DQM0, DDR_D_DQM1, DDR_D_DQS0, DDR_D_DQS1, DDR_D_DQSN0, DDR_D_DQSN1, DDR_D_ODT, DDR_D_RASn, DDR_D_WEn, DDR_DQM0, DDR_DQM1, DDR_DQS0, DDR_DQS1, DDR_DQSN0, DDR_DQSN1, DDR_ODT, DDR_RASn, DDR_RESETn, DDR_RESETN, DDR_VREF, DDR_VTP, DDR_WEn, ETHERCAT_TXEN, GND, GND_OSC, GND_OSC0, GND_RTC_OSC, GPMC_BEn1, JTAG_EMU0, JTAG_EMU1, JTAG_TCK, JTAG_TDI, JTAG_TDO, JTAG_TMS, JTAG_TRSTn, LCD_16, LCD_17, LCD_18, LCD_19, LCD_20, LCD_21, LCD_22, LCD_23, NAND_GPMC_ADVn_ALE, NAND_GPMC_BE0n_CLE, NAND_GPMC_CS0n, NAND_GPMC_OEn_REn, NAND_GPMC_WAIT, NAND_GPMC_WEn, NAND_GPMC_WPn, PMIC_DELAYEDRTCPORZ, PMIC_GPIO, PMIC_RESETOUTn, PMIC_Z, PORZ, PR1_MDIO_DATA, PR1_MDIO_MDCLK, PR1_MII1_RXD0, PR1_MII1_RXD1, PR1_MII1_RXD2, PR1_MII1_RXD3, PR1_MII1_RXDV, PR1_MII1_RXER, PR1_MII1_TXD0, PR1_MII1_TXD1, PR1_MII1_TXD2, PR1_MII1_TXD3, PR1_MII_MR1_CLK, PR1_MII_MT1_CLK, RTC_OSC_IN, RTC_OSC_OUT, SYS_RESETn, SYS_WARMRESETn, USR0, VREF_AM_DR, XDMA_EVENT_INTR0, XDMA_EVENT_INTR1
net class DDR3: 1V8, 3V3_GPIO, AM335X_DDR_A0, AM335X_DDR_A1, AM335X_DDR_A2, AM335X_DDR_A3, AM335X_DDR_A4, AM335X_DDR_A5, AM335X_DDR_A6, AM335X_DDR_A7, AM335X_DDR_A8, AM335X_DDR_A9, AM335X_DDR_A10, AM335X_DDR_A11, AM335X_DDR_A12, AM335X_DDR_A13, AM335X_DDR_A14, AM335X_DDR_A15, AM335X_DDR_BA0, AM335X_DDR_BA1, AM335X_DDR_BA2, AM335X_DDR_D0, AM335X_DDR_D1, AM335X_DDR_D2, AM335X_DDR_D3, AM335X_DDR_D4, AM335X_DDR_D5, AM335X_DDR_D6, AM335X_DDR_D7, AM335X_DDR_D8, AM335X_DDR_D9, AM335X_DDR_D10, AM335X_DDR_D11, AM335X_DDR_D12, AM335X_DDR_D13, AM335X_DDR_D14, AM335X_DDR_D15, AM335X_GPMC_AD0, AM335X_GPMC_AD1, AM335X_GPMC_AD2, AM335X_GPMC_AD3, AM335X_GPMC_AD4, AM335X_GPMC_AD5, AM335X_GPMC_AD6, AM335X_GPMC_AD7, AM335X_GPMC_AD8_LCD_23, AM335X_GPMC_AD9_LCD_22, AM335X_GPMC_AD10_LCD_21, AM335X_GPMC_AD11_LCD_20, AM335X_GPMC_AD12_LCD_19, AM335X_GPMC_AD13_LCD_18, AM335X_GPMC_AD14_LCD_17, AM335X_GPMC_AD15_LCD_16, AM335X_MMC0_CLK, AM335X_MMC0_CMD, AM335X_MMC0_D0, AM335X_MMC0_D1, AM335X_MMC0_D2, AM335X_MMC0_D3, AM335X_NMIn, AM335X_OSC0_IN, AM335X_OSC0_OUT, AM335X_PORZ, AM335X_RTC_PORZ, DDR_A_0, DDR_A_1, DDR_A_2, DDR_A_3, DDR_A_4, DDR_A_5, DDR_A_6, DDR_A_7, DDR_A_8, DDR_A_9, DDR_A_10, DDR_A_11, DDR_A_12, DDR_A_13, DDR_A_14, DDR_A_15, DDR_BA_0, DDR_BA_1, DDR_BA_2, DDR_CASn, DDR_CKE, DDR_CLK, DDR_CLKn, DDR_CSn, DDR_D_0, DDR_D_1, DDR_D_2, DDR_D_3, DDR_D_4, DDR_D_5, DDR_D_6, DDR_D_7, DDR_D_8, DDR_D_9, DDR_D_10, DDR_D_11, DDR_D_12, DDR_D_13, DDR_D_14, DDR_D_15, DDR_D_CASn, DDR_D_CKE, DDR_D_CLK, DDR_D_CLKn, DDR_D_CSn, DDR_D_DQM0, DDR_D_DQM1, DDR_D_DQS0, DDR_D_DQS1, DDR_D_DQSN0, DDR_D_DQSN1, DDR_D_ODT, DDR_D_RASn, DDR_D_WEn, DDR_DQM0, DDR_DQM1, DDR_DQS0, DDR_DQS1, DDR_DQSN0, DDR_DQSN1, DDR_ODT, DDR_RASn, DDR_RESETn, DDR_RESETN, DDR_VREF, DDR_VTP, DDR_WEn, ETHERCAT_TXEN, GND, GND_OSC, GND_OSC0, GND_RTC_OSC, GPMC_BEn1, JTAG_EMU0, JTAG_EMU1, JTAG_TCK, JTAG_TDI, JTAG_TDO, JTAG_TMS, JTAG_TRSTn, LCD_16, LCD_17, LCD_18, LCD_19, LCD_20, LCD_21, LCD_22, LCD_23, NAND_GPMC_ADVn_ALE, NAND_GPMC_BE0n_CLE, NAND_GPMC_CS0n, NAND_GPMC_OEn_REn, NAND_GPMC_WAIT, NAND_GPMC_WEn, NAND_GPMC_WPn, PMIC_DELAYEDRTCPORZ, PMIC_GPIO, PMIC_RESETOUTn, PMIC_Z, PORZ, PR1_MDIO_DATA, PR1_MDIO_MDCLK, PR1_MII1_RXD0, PR1_MII1_RXD1, PR1_MII1_RXD2, PR1_MII1_RXD3, PR1_MII1_RXDV, PR1_MII1_RXER, PR1_MII1_TXD0, PR1_MII1_TXD1, PR1_MII1_TXD2, PR1_MII1_TXD3, PR1_MII_MR1_CLK, PR1_MII_MT1_CLK, RTC_OSC_IN, RTC_OSC_OUT, SYS_RESETn, SYS_WARMRESETn, USR0, VREF_AM_DR, XDMA_EVENT_INTR0, XDMA_EVENT_INTR1

## Notes on the sheet
- Embedded CPU Design
- AM3359 CPU PERİPHERAL PART 1
- 1
- 1.8
- 20
- 1.4
- Labels drawn without touching a wire or pin: DDR_VTP
- (in symbol AM335X_15mmx15mm, part A) [OSC0_IN]; [PORZ]; [NRESETIN_OUT]; [OSC0_OUT]; [RTC_PORZ]; [NNMI]; [OSC1_IN]; [XDMA_EVENT_INTR0//TIMER4/CLKOUT1/SPI1_CS1/PR1_PRU1_PRU_R31_16/EMU2/GPIO0_19]; [XDMA_EVENT_INTR1//TCLKIN/CLKOUT2/TIMER7/PR1_PRU0_PRU_R31_16/EMU3/GPIO0_20]; [OSC1_OUT]; [NTRST]; AM335x; 15mm x 15mm Package; [GPMC_CLK/LCD_MEMORY_CLK/GPMC_WAIT1/MMC2_CLK/PR1_MII1_CRS/PR1_MDIO_MDCLK/MCASP0_FSR/GPIO2_1]; [GPMC_CSN0///////GPIO1_29]; [GPMC_CSN1/GPMC_CLK/MMC1_CLK/PR1_EDIO_DATA_IN6/PR1_EDIO_DATA_OUT6/PR1_PRU1_PRU_R30_12/PR1_PRU1_PRU_R31_12/GPIO1_30]; [GPMC_CSN2/GPMC_BE1N/MMC1_CMD/PR1_EDIO_DATA_IN7/PR1_EDIO_DATA_OUT7/PR1_PRU1_PRU_R30_13/PR1_PRU1_PRU_R31_13/GPIO1_31]; [GPMC_CSN3///MMC2_CMD/PR1_MII0_CRS/PR1_MDIO_DATA/EMU4/GPIO2_0]; [GPMC_WEN//TIMER6/////GPIO2_4]; [GPMC_OEN_REN//TIMER6/////GPIO2_4]; [GPMC_ADVN_ALE//TIMER4/////GPIO2_2]; [GPMC_BE0N_CLE//TIMER5/////GPIO2_5]; [GPMC_BE1N/GMII2_COL/GPMC_CSN6/MMC2_DAT3/GPMC_DIR/PR1_MII1_RXLINK/MCASP0_ACLKR/GPIO1_28]; [GPMC_WAIT0/GMII2_CRS/GPMC_CSN4/RMII2_CRS_DV/MMC1_SDCD/PR1_MII1_COL/UART4_RXD/GPIO0_30]; [GPMC_WPN/GMII2_RXERR/GPMC_CSN5/RMII2_RXERR/MMC2_SDCD/PR1_MII1_TXEN/UART4_TXD/GPIO0_31]; [GPMC_AD0/MMC1_DAT0//////GPIO1_0]; [GPMC_AD1/MMC1_DAT1//////GPIO1_1]; [GPMC_AD2/MMC1_DAT2//////GPIO1_2]; [GPMC_AD3/MMC1_DAT3//////GPIO1_3]; [GPMC_AD4/MMC1_DAT4//////GPIO1_4]; [GPMC_AD5/MMC1_DAT5//////GPIO1_5]; [GPMC_AD6/MMC1_DAT6//////GPIO1_6]; [GPMC_AD7/MMC1_DAT7//////GPIO1_7]; [GPMC_AD8/LCD_DATA23/MMC1_DAT0/MMC2_DAT4/EHRPWM2A/PR1_MII_MT0_CLK//GPIO0_22]; [GPMC_AD9/LCD_DATA22/MMC1_DAT1/MMC2_DAT5/EHRPWM2B/PR1_MII0_COL//GPIO0_23]; [GPMC_AD10/LCD_DATA21/MMC1_DAT2/MMC2_DAT6/EHRPWM2_TRIPZONE_INPUT/PR1_MII0_TXEN//GPIO0_26]; [GPMC_AD11/LCD_DATA20/MMC1_DAT3/MMC2_DAT7/EHRPWM2_SYNCO/PR1_MII0_TXD3//GPIO0_27]; [GPMC_AD12/LCD_DATA19/MMC1_DAT4/MMC2_DAT0/EQEP2A_IN/PR1_MII0_TXD2/PR1_PRU0_PRU_R30_14/GPIO1_12]; [GPMC_AD13/LCD_DATA18/MMC1_DAT5/MMC2_DAT1/EQEP2B_IN/PR1_MII0_TXD1/PR1_PRU0_PRU_R30_15/GPIO1_13]; [GPMC_AD14/LCD_DATA17/MMC1_DAT6/MMC2_DAT2/EQEP2_INDEX/PR1_MII0_TXD0/PR1_PRU0_PRU_R31_14/GPIO1_14]; [GPMC_AD15/LCD_DATA16/MMC1_DAT7/MMC2_DAT3/EQEP2_STROBE/PR1_ECAP0_ECAP_CAPIN_APWM_O/PR1_PRU0_PRU_R31_15/GPIO1_15]; [GPMC_A0/GMII2_TXEN/RGMII2_TCTL/RMII2_TXEN/GPMC_A16/PR1_MII_MT1_CLK/EHRPWM1_TRIPZONE_INPUT/GPIO1_16]; [GPMC_A1/GMII2_RXDV/RGMII2_RCTL/MMC2_DAT0/GPMC_A17/PR1_MII1_TXD3/EHRPWM0_SYNCO/GPIO1_17]; [GPMC_A2/GMII2_TXD3/RGMII2_TD3/MMC2_DAT1/GPMC_A18/PR1_MII1_TXD2/EHRPWM1A/GPIO1_18]; [DDR_NCK]; [GPMC_A3/GMII2_TXD2/RGMII2_TD2/MMC2_DAT2/GPMC_A19/PR1_MII1_TXD1/EHRPWM1B/GPIO1_19]; [GPMC_A4/GMII2_TXD1/RGMII2_TD1/RMII2_TXD1/GPMC_A20/PR1_MII1_TXD0/EQEP1A_IN/GPIO1_20]; [DDR_CSN0]; [GPMC_A5/GMII2_TXD0/RGMII2_TD0/RMII2_TXD0/GPMC_A21/PR1_MII1_RXD3/EQEP1B_IN/GPIO1_21]; [DDR_CASN]; [GPMC_A6/GMII2_TXCLK/RGMII2_TCLK/MMC2_DAT4/GPMC_A22/PR1_MII1_RXD2/EQEP1_INDEX/GPIO1_22]; [DDR_RASN]; [GPMC_A7/GMII2_RXCLK/RGMII2_RCLK/MMC2_DAT5/GPMC_A23/PR1_MII1_RXD1/EQEP1_STROBE/GPIO1_23]; [DDR_WEN]; [GPMC_A8/GMII2_RXD3/RGMII2_RD3/MMC2_DAT6/GPMC_A24/PR1_MII1_RXD0/MCASP0_ACLKX/GPIO1_24]; [GPMC_A9/GMII2_RXD2/RGMII2_RD2/MMC2_DAT7/GPMC_A25/PR1_MII_MR1_CLK/MCASP0_FSX/GPIO1_25]; [GPMC_A10/GMII2_RXD1/RGMII2_RD1/RMII2_RXD1/GPMC_A26/PR1_MII1_RXDV/MCASP0_AXR0/GPIO1_26]; [GPMC_A11/GMII2_RXD0/RGMII2_RD0/RMII2_RXD0/GPMC_A27/PR1_MII1_RXER/MCASP0_AXR1/GPIO1_27]; [DDR_DQSN0]; [MMC0_CLK/GPMC_A24/UART3_CTSN/UART2_RXD/DCAN1_TX/PR1_PRU0_PRU_R30_12/PR1_PRU0_PRU_R31_12/GPIO2_30]; [DDR_DQSN1]; [MMC0_CMD/GPMC_A25/UART3_RTSN/UART2_TXD/DCAN1_RX/PR1_PRU0_PRU_R30_13/PR1_PRU0_PRU_R31_13/GPIO2_31]; [MMC0_DAT0/GPMC_A23/UART5_RTSN/UART3_TXD/UART1_RIN/PR1_PRU0_PRU_R30_11/PR1_PRU0_PRU_R31_11/GPIO2_29]; [MMC0_DAT1/GPMC_A22/UART5_CTSN/UART3_RXD/UART1_DTRN/PR1_PRU0_PRU_R30_10/PR1_PRU0_PRU_R31_10/GPIO2_28]; [DDR_RESETN]; [MMC0_DAT2/GPMC_A21/UART4_RTSN/TIMER6/UART1_DSRN/PR1_PRU0_PRU_R30_9/PR1_PRU0_PRU_R31_9/GPIO2_27]; [MMC0_DAT3/GPMC_A20/UART4_CTSN/TIMER5/UART1_DCDN/PR1_PRU0_PRU_R30_8/PR1_PRU0_PRU_R31_8/GPIO2_26]
- (in symbol SDTitleBlock) Title:; Page Contents:; Designer:; DWG NO; Revision:; Date:; Sheet; of

## Library data of the parts
C1-C4 = 18PF,50V,0805: MULTICOMP - MC0805N180J500CT - CAP, MLCC, C0G/NP0, 18PF, 50V,0805, REEL; Product Range: MULTICOMP - MC Series; Capacitance: 18; Capacitance Tolerance: ± 5%; Voltage Rating: 50; Ceramic Capacitor Case: 0805 [2012 Metric]; Capacitor Terminals: SMD; Reel Quantity: 4000; Tolerance: ±5%; Temperature Coefficient: C0G, NP0; Supplier 1: Digi-Key; Manufacturer: MULTICOMP; Manufacturer Part Number: MC0805N180J500CT; RoHS: YES; Pricing 1: 1=0.1, 10=0.048, 25=0.034, 50=0.026, 100=0.022, 250=0.018, 500=0.0154, 1000=0.012 (USD); Dielectric Characteristic: C0G / NP0; Operating Temperature Min: -55; Operating Temperature Max: 125; Packaging: Tape & Reel; MSL: -; Capacitance Tolerance ±: ± 5%; Capacitor Case Style: 0805 [2012 Metric]; ComponentLink1URL: http://www.farnell.com/datasheets/1792107.pdf; ComponentLink1Description: http://www.farnell.com/datasheets/1792107.pdf; Supplier Part Number 1: 709-1171-1-ND; Category: Capacitors; Stock 1: 33659; Voltage - Rated: 50V; Mounting Type: Surface Mount, MLCC; Operating Temperature: -55°C ~ 125°C; Applications: General Purpose; Ratings: -; Package / Case: 0805 (2012 Metric); Size / Dimension: 0.080" L x 0.050" W (2.03mm x 1.27mm); Height - Seated (Max): -; Thickness (Max): 0.050" (1.27mm); Lead Spacing: -; Features: -; Lead Style: -; ComponentLink2URL: http://www.johansondielectrics.com/images/stories/surface-mount/smt-mlc/JDI_Surface-Mount_2012-01.pdf; ComponentLink2Description: http://www.johansondielectrics.com/images/stories/surface-mount/smt-mlc/JDI_Surface-Mount_2012-01.pdf
C5 = 0.1UF,6.3V,0805: CAP CER 0.1UF 6.3V 10% X7R 0805; Manufacturer: Kemet; Manufacturer Part Number: C0805C104K9RACTU; Capacitance: 0.1µF; Supplier 1: Digi-Key; RoHS: RoHS Compliant; Category: Capacitors; Stock 1: 19204; Pricing 1: 1=0.12, 10=0.083, 25=0.062, 50=0.0476, 100=0.0392, 250=0.03304, 1000=0.02228 (USD); Packaging: Digi-Reel®; Tolerance: ±10%; Voltage - Rated: 6.3V; Temperature Coefficient: X7R; Mounting Type: Surface Mount, MLCC; Operating Temperature: -55°C ~ 125°C; Applications: General Purpose; Ratings: -; Package / Case: 0805 (2012 Metric); Size / Dimension: 0.079" L x 0.049" W (2.00mm x 1.25mm); Height - Seated (Max): -; Thickness (Max): 0.035" (0.88mm); Lead Spacing: -; Features: -; Lead Style: -; ComponentLink1URL: http://www.kemet.com/docfinder?Partnumber=C0805C104K9RACTU; ComponentLink1Description: http://www.kemet.com/docfinder?Partnumber=C0805C104K9RACTU; Supplier Part Number 1: 399-9155-6-ND
R1 R3 R4 R7 R8 = 0R,0805: BOURNS - CR0805-J/-000ELF - RESISTOR, 0805, 0R, 5%, 1/8W; Product Range: BOURNS - CR Series; Resistance: 0; Power Rating: 125; Resistor Case Style: 0805 [2012 Metric]; Resistor Element Material: Thick Film; Temperature Coefficient: -250ppm/°C to +500; Voltage Rating: 150; SVHC: No SVHC (16-Jun-2014); Resistor Mounting: SMD<!--FANDB--><div class="features-and-benefits-container"></div>; Connector Type: RJ45; Number of Ports: 1; LED Color: Green - Yellow; Number of Cores per Jack: 6; Shielding: Shielded, EMI Finger; Tab Direction: Up; Shield Material: Brass; Resistance (Ohms): 0.0; Tolerance: Jumper; Power (Watts): 0.125W, 1/8W; Manufacturer: BOURNS; Manufacturer Part Number: CR0805-J/-000ELF; RoHS: YES; Resistance Tolerance: ± 5%; Packaging: Cut Tape; MSL: MSL 1 - Unlimited; ComponentLink1URL: http://www.farnell.com/datasheets/1845293.pdf; ComponentLink1Description: http://www.farnell.com/datasheets/1845293.pdf; Category: Connectors, Interconnects; Number of Rows: 1; Applications: 10/100 Base-T, AutoMDIX; Mounting Type: Through Hole; Orientation: 90° Angle (Right); Termination: Solder; Height Above Board: 0.555" (14.10mm); Features: Board Lock, Decoupling Capacitance; Contact Material: Phosphor Bronze; Contact Finish: Gold; Contact Finish Thickness: 50µin (1.27µm); Housing Material: Polyethylene Terephthalate (PET), Polyester; Operating Temperature: 0°C ~ 70°C; ComponentLink2URL: http://www.trpconnector.com/pdfs/6605728.pdf; ComponentLink2Description: http://www.trpconnector.com/pdfs/6605728.pdf; Supplier 1: Digi-Key; Stock 1: 1539206; Pricing 1: 1=0.1, 50=0.0196, 100=0.0149, 250=0.01104, 500=0.00816, 1000=0.00544, 2500=0.00459 (USD); Composition: Thick Film; Package / Case: 0805 (2012 Metric); Supplier Device Package: 0805; Size / Dimension: 0.079" L x 0.049" W (2.00mm x 1.25mm); Height: 0.028" (0.70mm); Number of Terminations: 2; ComponentLink3URL: http://industrial.panasonic.com/www-cgi/jvcr13pz.cgi?E+PZ+3+AOA0001+ERJ6GEY0R00V+7+WW; ComponentLink3Description: http://industrial.panasonic.com/www-cgi/jvcr13pz.cgi?E+PZ+3+AOA0001+ERJ6GEY0R00V+7+WW; Supplier Part Number 1: P0.0ACT-ND
R2 R5 = 100K,0805: TE CONNECTIVITY / NEOHM - CPF0805B100KE1 - RESISTOR, 0805, 100K; Product Range: TE CONNECTIVITY - CPF Series; Resistance: 100; Resistance Tolerance: ± 0.1%; Resistor Case Style: 0805 [2012 Metric]; Resistor Element Material: Thin Film; Temperature Coefficient: ± 25; Voltage Rating: 200; External Depth: 0.5; External Length / Height: 2; External Width: 1.25; Resistor Mounting: SMD; Tolerance: ±5%; Power (Watts): 0.125W, 1/8W; Supplier 1: Digi-Key; Manufacturer: TE CONNECTIVITY / NEOHM; Manufacturer Part Number: CPF0805B100KE1; RoHS: YES; Stock 1: 923150; Pricing 1: 1=0.1, 50=0.0196, 100=0.0149, 250=0.01104, 500=0.00816, 1000=0.00544, 2500=0.00459 (USD); Power Rating: 100; Packaging: Cut Tape; MSL: -; No. of Pins: 2; Operating Temperature Max: 155; Operating Temperature Min: -55; Operating Temperature Range: -55°C to +155; Series: CPF<!--FANDB--><div class="features-and-benefits-container"></div>; ComponentLink1URL: http://www.tycoelectronics.com/commerce/DocumentDelivery/DDEController?Action=srchrtrv&DocNm=1614883&DocType=Customer+Drawing&DocLang=English; ComponentLink1Description: http://www.tycoelectronics.com/commerce/DocumentDelivery/DDEController?Action=srchrtrv&DocNm=1614883&DocType=Customer+Drawing&DocLang=English; ComponentLink2URL: http://www.tycoelectronics.com/commerce/DocumentDelivery/DDEController?Action=srchrtrv&DocNm=1773200&DocType=Data+Sheet&DocLang=English; ComponentLink2Description: http://www.tycoelectronics.com/commerce/DocumentDelivery/DDEController?Action=srchrtrv&DocNm=1773200&DocType=Data+Sheet&DocLang=English; Supplier Part Number 1: P100KACT-ND; Category: Resistors; Resistance (Ohms): 100k; Composition: Thick Film; Features: Automotive AEC-Q200; Operating Temperature: -55°C ~ 155°C; Package / Case: 0805 (2012 Metric); Supplier Device Package: 0805; Size / Dimension: 0.079" L x 0.049" W (2.00mm x 1.25mm); Height: 0.028" (0.70mm); Number of Terminations: 2; ComponentLink3URL: http://industrial.panasonic.com/www-cgi/jvcr13pz.cgi?E+PZ+3+AOA0001+ERJ6GEYJ104V+7+WW; ComponentLink3Description: http://industrial.panasonic.com/www-cgi/jvcr13pz.cgi?E+PZ+3+AOA0001+ERJ6GEYJ104V+7+WW
R6 = 10K,0805: BOURNS - CR0805-FX-1002GLF - RESISTOR, 10K, 0.125W, 1%; Product Range: BOURNS - CR Series; Resistance: 10; Power Rating: 125; Resistor Case Style: 0805 [2012 Metric]; Resistor Element Material: Thick Film; Temperature Coefficient: ± 100; Voltage Rating: 150; SVHC: No SVHC (16-Jun-2014); Resistor Mounting: SMD<!--FANDB--><div class="features-and-benefits-container"></div>; Power (Watts): 0.125W, 1/8W; Supplier 1: Digi-Key; Manufacturer: BOURNS; Manufacturer Part Number: CR0805-FX-1002GLF; RoHS: YES; Stock 1: 1116166; Pricing 1: 1=0.1, 10=0.029, 50=0.0162, 100=0.0123, 250=0.00912, 500=0.00672, 1000=0.00448, 2500=0.00378 (USD); Resistance Tolerance: ± 1%; Packaging: Cut Tape; MSL: MSL 1 - Unlimited; ComponentLink1URL: http://www.farnell.com/datasheets/1845293.pdf; ComponentLink1Description: http://www.farnell.com/datasheets/1845293.pdf; Supplier Part Number 1: RMCF0805FT10K0CT-ND; Category: Resistors; Resistance (Ohms): 10k; Tolerance: ±1%; Composition: Thick Film; Features: -; Operating Temperature: -55°C ~ 155°C; Package / Case: 0805 (2012 Metric); Supplier Device Package: 0805; Size / Dimension: 0.079" L x 0.049" W (2.00mm x 1.25mm); Height: 0.026" (0.65mm); Number of Terminations: 2; ComponentLink2URL: http://www.seielect.com/Catalog/SEI-RMCF_RMCP.pdf; ComponentLink2Description: http://www.seielect.com/Catalog/SEI-RMCF_RMCP.pdf
R9 = 1M,0805: MULTICOMP - MC0805S8F1004T5E - RESISTOR, THICK FILM, 1MOHM, 125mW, 1%; Product Range: MULTICOMP - MC Series; Resistance: 1; Power Rating: 125; Resistor Case Style: 0805 ^2012 Metric]; Power (Watts): 0.125W, 1/8W; Temperature Coefficient: ±100ppm/°C; Supplier 1: Digi-Key; Manufacturer: MULTICOMP; Manufacturer Part Number: MC0805S8F1004T5E; RoHS: Y-EX; Stock 1: 548421; Pricing 1: 1=0.1, 50=0.0288, 100=0.0219, 250=0.01624, 500=0.012, 1000=0.008, 2500=0.00675 (USD); Resistance Tolerance: ± 1%; Resistor Element Type: Thick Film; MSL: -; ComponentLink1URL: http://www.newark.com/pdfs/datasheets/spc/TA-677.pdf; ComponentLink1Description: http://www.newark.com/pdfs/datasheets/spc/TA-677.pdf; Supplier Part Number 1: P1.00MCCT-ND; Category: Resistors; Packaging: Cut Tape (CT); Resistance (Ohms): 1M; Tolerance: ±1%; Composition: Thick Film; Features: Automotive AEC-Q200; Operating Temperature: -55°C ~ 155°C; Package / Case: 0805 (2012 Metric); Supplier Device Package: 0805; Size / Dimension: 0.079" L x 0.049" W (2.00mm x 1.25mm); Height: 0.028" (0.70mm); Number of Terminations: 2; ComponentLink2URL: http://industrial.panasonic.com/www-cgi/jvcr13pz.cgi?E+PZ+3+AOA0002+ERJ6ENF1004V+7+WW; ComponentLink2Description: http://industrial.panasonic.com/www-cgi/jvcr13pz.cgi?E+PZ+3+AOA0002+ERJ6ENF1004V+7+WW
R10 = 49.9R,0402: RES SMD 49.9 OHM 0.1% 1/16W 0402; Manufacturer: TE Connectivity; Manufacturer Part Number: CPF0402B49R9E; Resistance (Ohms): 49.9; Power (Watts): 0.063W, 1/16W; Temperature Coefficient: ±25ppm/°C; Supplier 1: Digi-Key; RoHS: RoHS Compliant; Category: Resistors; Stock 1: 4750; Pricing 1: 1=0.63, 10=0.484, 25=0.368, 50=0.2734, 100=0.2033, 250=0.17176, 500=0.14722, 1000=0.11216, 2500=0.10516 (USD); Packaging: Cut Tape (CT); Tolerance: ±0.1%; Composition: Thin Film; Features: -; Operating Temperature: -55°C ~ 155°C; Package / Case: 0402 (1005 Metric); Supplier Device Package: 0402; Size / Dimension: 0.039" L x 0.020" W (1.00mm x 0.50mm); Height: 0.014" (0.35mm); Number of Terminations: 2; ComponentLink1URL: http://www.te.com/commerce/DocumentDelivery/DDEController?Action=srchrtrv&DocNm=1773200&DocType=DS&DocLang=English; ComponentLink1Description: http://www.te.com/commerce/DocumentDelivery/DDEController?Action=srchrtrv&DocNm=1773200&DocType=DS&DocLang=English; Supplier Part Number 1: A119944CT-ND
SW1 = Switch_Pushbutton_smd: Switch Push Button tactile; TIIntPartnumber: 2W0018; MfrNum: B3SL-1022P; Mfr: Omron; PartName: SwitchPushMomTactilesmd; Cost10K: 0.25; Cost100: 0.340; Vendor: Digikey; DescriptiveText: Switch Push Button tactile; Descriptive_Text: Switch Push Button tactile
U1 = SN74AUP2G08: Low Power Dual AND Gate; Mfr: TI; MfrNum: SN74AUP2G08DCU; TIIntPartnumber: 1A0249; Manufacturer: Texas Instruments; Manufacturer Part Number: SN74AUP2G08DCUR; Vendor: Digikey; Cost100: 0.11; Cost10K: 0.05; Number of Circuits: 2; Voltage - Supply: 0.8 V ~ 3.6 V; Current - Quiescent (Max): 0.5µA; Current - Output High, Low: 4mA, 4mA; Logic Level - Low: 0.7 V ~ 0.9 V; Logic Level - High: 1.6 V ~ 2 V; Max Propagation Delay @ V, Max CL: 6.7ns @ 3.3V, 30pF; DescriptiveText: Low Power Dual AND Gate; PartName: SN74AUP2G08; Descriptive_Text: Low Power Dual AND Gate; Supplier 1: Digi-Key; RoHS: RoHS Compliant; Category: Integrated Circuits (ICs); Stock 1: 4923; Pricing 1: 1=0.66, 10=0.578, 25=0.5104, 100=0.4448, 250=0.3872, 500=0.3296, 750=0.288, 1000=0.264 (USD); Packaging: Cut Tape (CT); Logic Type: AND Gate; Number of Inputs: 2; Features: Schmitt Trigger; Operating Temperature: -40°C ~ 85°C; Mounting Type: Surface Mount; Supplier Device Package: US8; Package / Case: 8-VFSOP (0.091", 2.30mm Width); ComponentLink1URL: http://www.ti.com/lit/ds/symlink/sn74aup2g08.pdf; ComponentLink1Description: http://www.ti.com/lit/ds/symlink/sn74aup2g08.pdf; Supplier Part Number 1: 296-32271-1-ND
U2 = AM335X_15mmx15mm: SubArctic Cortex A8 Processor 15x15; PartName: AM335X_15x15; Mfr: TI; MfrNum: AM335x 15x15 FBGA ZCE; TIIntPartnumber: 1A0242; Vendor: Arrow; Cost100: 10.00; Cost10K: 10.00; Supplier 1: Digi-Key
Y1 = Crystal_SMD32_768kHz: Crystal 32.768KHz; TIIntPartnumber: 1Y0029; MfrNum: MC-30632.7680k-A; Mfr: Epson; PartName: Crystal32.768KHzMC306; Cost10K: 0.338; Cost100: 0.41; Vendor: Digikey; TN: tbd; Descriptive_Text: Crystal 32.768KHz; DescriptiveText: Crystal 32.768KHz; Supplier 1: Digi-Key; Supplier Part Number 1: SER2407TR-ND
Y2 = Crystal25MHzABM3: Crystal 25MHz; TIIntPartnumber: 1Y0030; MfrNum: ABM3-25.000MHz-B2-T; Mfr: Abracon; Manufacturer: Abracon Corporation; Cost10K: 0.51; Cost100: 0.90; Vendor: Digikey; TN: tbd; Frequency Stability: ±50ppm; Frequency Tolerance: ±20ppm; Load Capacitance: 18pF; ESR (Equivalent Series Resistance): 30 Ohm; Operating Mode: Fundamental; Descriptive_Text: Crystal 25MHz; PartName: Crystal25MHzABM3; DescriptiveText: Crystal 25MHz; Supplier 1: Digi-Key; Supplier Part Number 1: 535-9108-1-ND; Manufacturer Part Number: ABM3-25.000MHZ-B2-T; RoHS: RoHS Compliant; Category: Crystals and Oscillators; Stock 1: 10200; Pricing 1: 1=1.04, 10=0.92, 50=0.8588, 100=0.76, 500=0.7182 (USD); Packaging: Cut Tape (CT); Type: MHz Crystal; Frequency: 25MHz; Operating Temperature: -20°C ~ 70°C; Ratings: -; Mounting Type: Surface Mount; Package / Case: 2-SMD; Size / Dimension: 0.197" L x 0.126" W (5.00mm x 3.20mm); Height: 0.051" (1.30mm); ComponentLink1URL: http://www.abracon.com/Resonators/abm3.pdf; ComponentLink1Description: http://www.abracon.com/Resonators/abm3.pdf